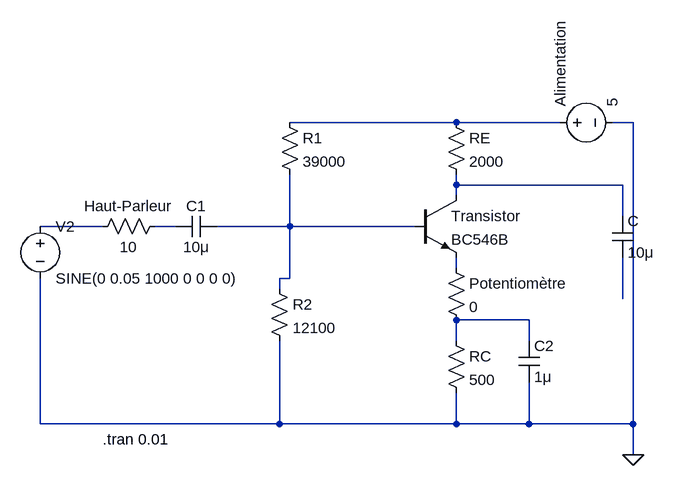
[diagram p0: schematic Livrable N°3 Circuit classe A + Potentiomètre.asc]
Livrable N°3 Circuit classe A + Potentiomètre.asc, the LTspice schematic file:
Version 4
SHEET 1 1104 680
WIRE 368 16 112 16
WIRE 528 16 368 16
WIRE 640 16 608 16
WIRE 368 112 368 96
WIRE 624 112 368 112
WIRE 368 128 368 112
WIRE 624 160 624 112
WIRE -176 176 -272 176
WIRE -64 176 -96 176
WIRE 112 176 112 96
WIRE 112 176 0 176
WIRE 304 176 112 176
WIRE 368 240 368 224
WIRE 112 256 112 176
WIRE 112 256 96 256
WIRE 96 272 96 256
WIRE 624 288 624 224
WIRE 480 320 368 320
WIRE 368 352 368 320
WIRE 480 352 480 320
WIRE -272 480 -272 256
WIRE 96 480 96 352
WIRE 96 480 -272 480
WIRE 368 480 368 432
WIRE 368 480 96 480
WIRE 480 480 480 416
WIRE 480 480 368 480
WIRE 640 480 640 16
WIRE 640 480 480 480
WIRE 640 528 640 480
FLAG 640 528 0
SYMBOL res 352 0 R0
SYMATTR InstName RE
SYMATTR Value 2000
SYMBOL res 352 336 R0
SYMATTR InstName RC
SYMATTR Value 500
SYMBOL res 96 0 R0
SYMATTR InstName R1
SYMATTR Value 39000
SYMBOL res 80 256 R0
SYMATTR InstName R2
SYMATTR Value 12100
SYMBOL npn 304 128 R0
SYMATTR InstName Transistor
SYMATTR Value BC546B
SYMBOL voltage 512 16 R270
WINDOW 123 0 0 Left 0
WINDOW 39 0 0 Left 0
SYMATTR InstName Alimentation
SYMATTR Value 5
SYMBOL cap 608 160 R0
SYMATTR InstName C
SYMATTR Value 10μ
SYMBOL voltage -272 160 R0
WINDOW 123 24 124 Left 2
WINDOW 39 0 0 Left 0
SYMATTR InstName V2
SYMATTR Value SINE(0 0.05 1000 0 0 0 0)
SYMBOL cap 0 160 R90
WINDOW 0 0 32 VBottom 2
WINDOW 3 32 32 VTop 2
SYMATTR InstName C1
SYMATTR Value 10μ
SYMBOL cap 464 352 R0
SYMATTR InstName C2
SYMATTR Value 1μ
SYMBOL res -80 160 R90
WINDOW 0 0 56 VBottom 2
WINDOW 3 32 56 VTop 2
SYMATTR InstName Haut-Parleur
SYMATTR Value 10
SYMBOL res 352 224 R0
SYMATTR InstName Potentiomètre
SYMATTR Value 0
TEXT -176 504 Left 2 !.tran 0.01

The netlist it stands for:
* Livrable N°3 Circuit classe A + Potentiomètre.asc
RE N001 N002 2000
RC N008 0 500
R1 N001 N005 39000
R2 N005 0 12100
Q§Transistor N002 N005 N006 0 BC546B
V§Alimentation N001 0 5
C N002 N007 10μ
V2 N003 0 SINE(0 0.05 1000 0 0 0 0)
C1 N005 N004 10μ
C2 N008 0 1μ
R§Haut-Parleur N004 N003 10
R§Potentiomètre N006 N008 0
.model NPN NPN
.model PNP PNP
.lib standard.bjt
.tran 0.01
.backanno
.end